# EAGLE design rf24-isp (EAGLE 6.1)
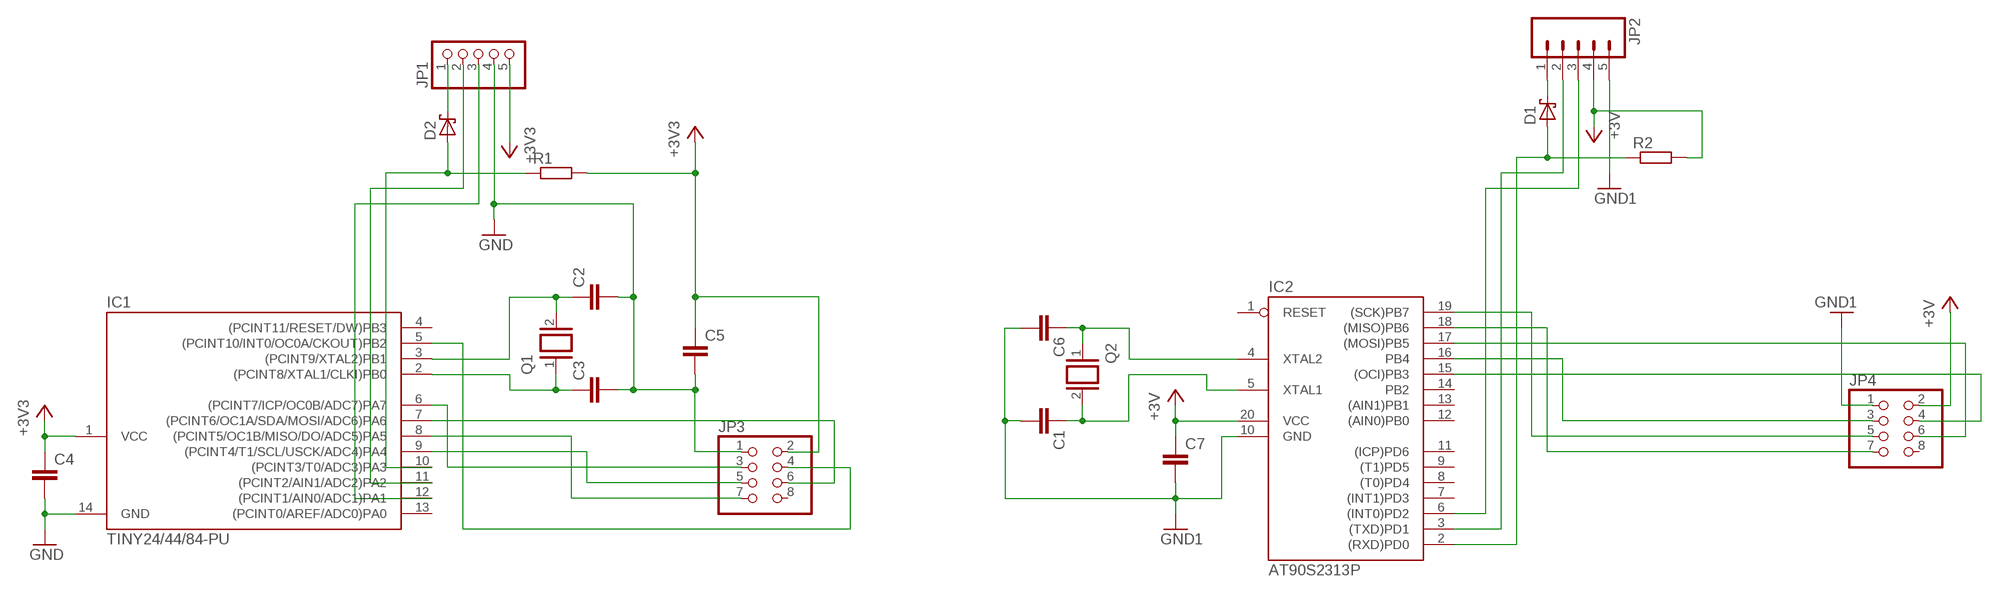
[diagram p0: schematic, sheet 1]

## Parts
C1  C-EU025-025X050  [C025-025X050]
C2  C-EU025-025X050  [C025-025X050]
C3  C-EU025-025X050  [C025-025X050]
C4  C-EU025-025X050  [C025-025X050]
C5  C-EU025-025X050  [C025-025X050]
C6  C-EU025-025X050  [C025-025X050]
C7  C-EU025-025X050  [C025-025X050]
D1  SCHOTTKY-DIODETO92H  [TO92H]
D2  SCHOTTKY-DIODETO92H  [TO92H]
IC1  TINY24/44/84-PU  [DIL14]
IC2  AT90S2313P  [DIL20]
JP1  PINHD-1X5  [1X05]
JP2  M05PTH  [1X05]
JP3  PINHD-2X4  [2X04]
JP4  PINHD-2X4  [2X04]
Q1  XTAL/S  [QS]
Q2  XTAL/S  [QS]
R1  R-EU_0207/12  [0207/12]
R2  R-EU_0207/2V  [0207/2V]

## Nets
+3V3: C4.1 C5.1 C7.1 IC1.1(VCC) IC2.20(VCC) JP1.5 JP2.4 JP3.2 JP4.2 R1.2 R2.2 ; supply symbol labelled +3V
GND: C1.2 C2.2 C3.2 C4.2 C5.2 C6.2 C7.2 IC1.14(GND) IC2.10(GND) JP1.4 JP2.5 JP3.1 JP4.1 ; supply symbol labelled GND1
N$1: C2.1 IC1.3((PCINT9/XTAL2)PB1) Q1.2
N$2: C3.1 IC1.2((PCINT8/XTAL1/CLKI)PB0) Q1.1
N$3: D2.2(C) JP1.1
N$4: IC1.7((PCINT6/OC1A/SDA/MOSI/ADC6)PA6) JP3.6
N$5: IC1.6((PCINT7/ICP/OC0B/ADC7)PA7) JP3.3
N$6: IC1.9((PCINT4/T1/SCL/USCK/ADC4)PA4) JP3.5
N$7: IC1.8((PCINT5/OC1B/MISO/DO/ADC5)PA5) JP3.7
N$8: IC1.5((PCINT10/INT0/OC0A/CKOUT)PB2) JP3.4
N$9: IC2.16(PB4) JP4.3
N$13: D1.2(C) JP2.1
N$14: IC2.19((SCK)PB7) JP4.5
N$15: IC2.18((MISO)PB6) JP4.7
N$16: IC2.17((MOSI)PB5) JP4.6
N$18: IC2.15((OCI)PB3) JP4.4
N$21: C1.1 IC2.5(XTAL1) Q2.2
N$22: C6.1 IC2.4(XTAL2) Q2.1
RST0: IC1.12((PCINT1/AIN0/ADC1)PA1) JP1.3
RST1: IC2.6((INT0)PD2) JP2.3
RX0: IC1.11((PCINT2/AIN1/ADC2)PA2) JP1.2
RX1: IC2.3((TXD)PD1) JP2.2
TX: D2.1(A) IC1.10((PCINT3/T0/ADC3)PA3) R1.1
TX1: D1.1(A) IC2.2((RXD)PD0) R2.1
Unconnected: IC1.4((PCINT11/RESET/DW)PB3) IC1.13((PCINT0/AREF/ADC0)PA0) IC2.1(RESET) IC2.7((INT1)PD3) IC2.8((T0)PD4) IC2.9((T1)PD5) IC2.11((ICP)PD6) IC2.12((AIN0)PB0) IC2.13((AIN1)PB1) IC2.14(PB2) JP3.8 JP4.8

## Library data of the parts
C1-C7 = rcl:C-EU: CAPACITOR, European symbol
D1 D2 = diode:SCHOTTKY-DIODE: Schottky Diode
IC1 = avr-5:TINY24/44/84
IC2 = avr-5:AT90S2313: MICROCONTROLLER 2 Kbytes FLASH 128 bytes SRAM 128 bytes EEPROM UART
JP1 = pinhead:PINHD-1X5: PIN HEADER
JP2 = SparkFun:M05: Header 5 Standard 5-pin 0.1" header. Use with straight break away headers (SKU : PRT-00116), right angle break away headers (PRT-00553), swiss pins (PRT-00743), machine pins (PRT-00117), and female headers (PRT-00115). Molex polarized connector foot print use with SKU : PRT-08230 with associated crimp pins and housings.
JP3 JP4 = pinhead:PINHD-2X4: PIN HEADER
Q1 Q2 = special:XTAL/S: CRYSTAL
R1 R2 = rcl:R-EU_: RESISTOR, European symbol

## Board
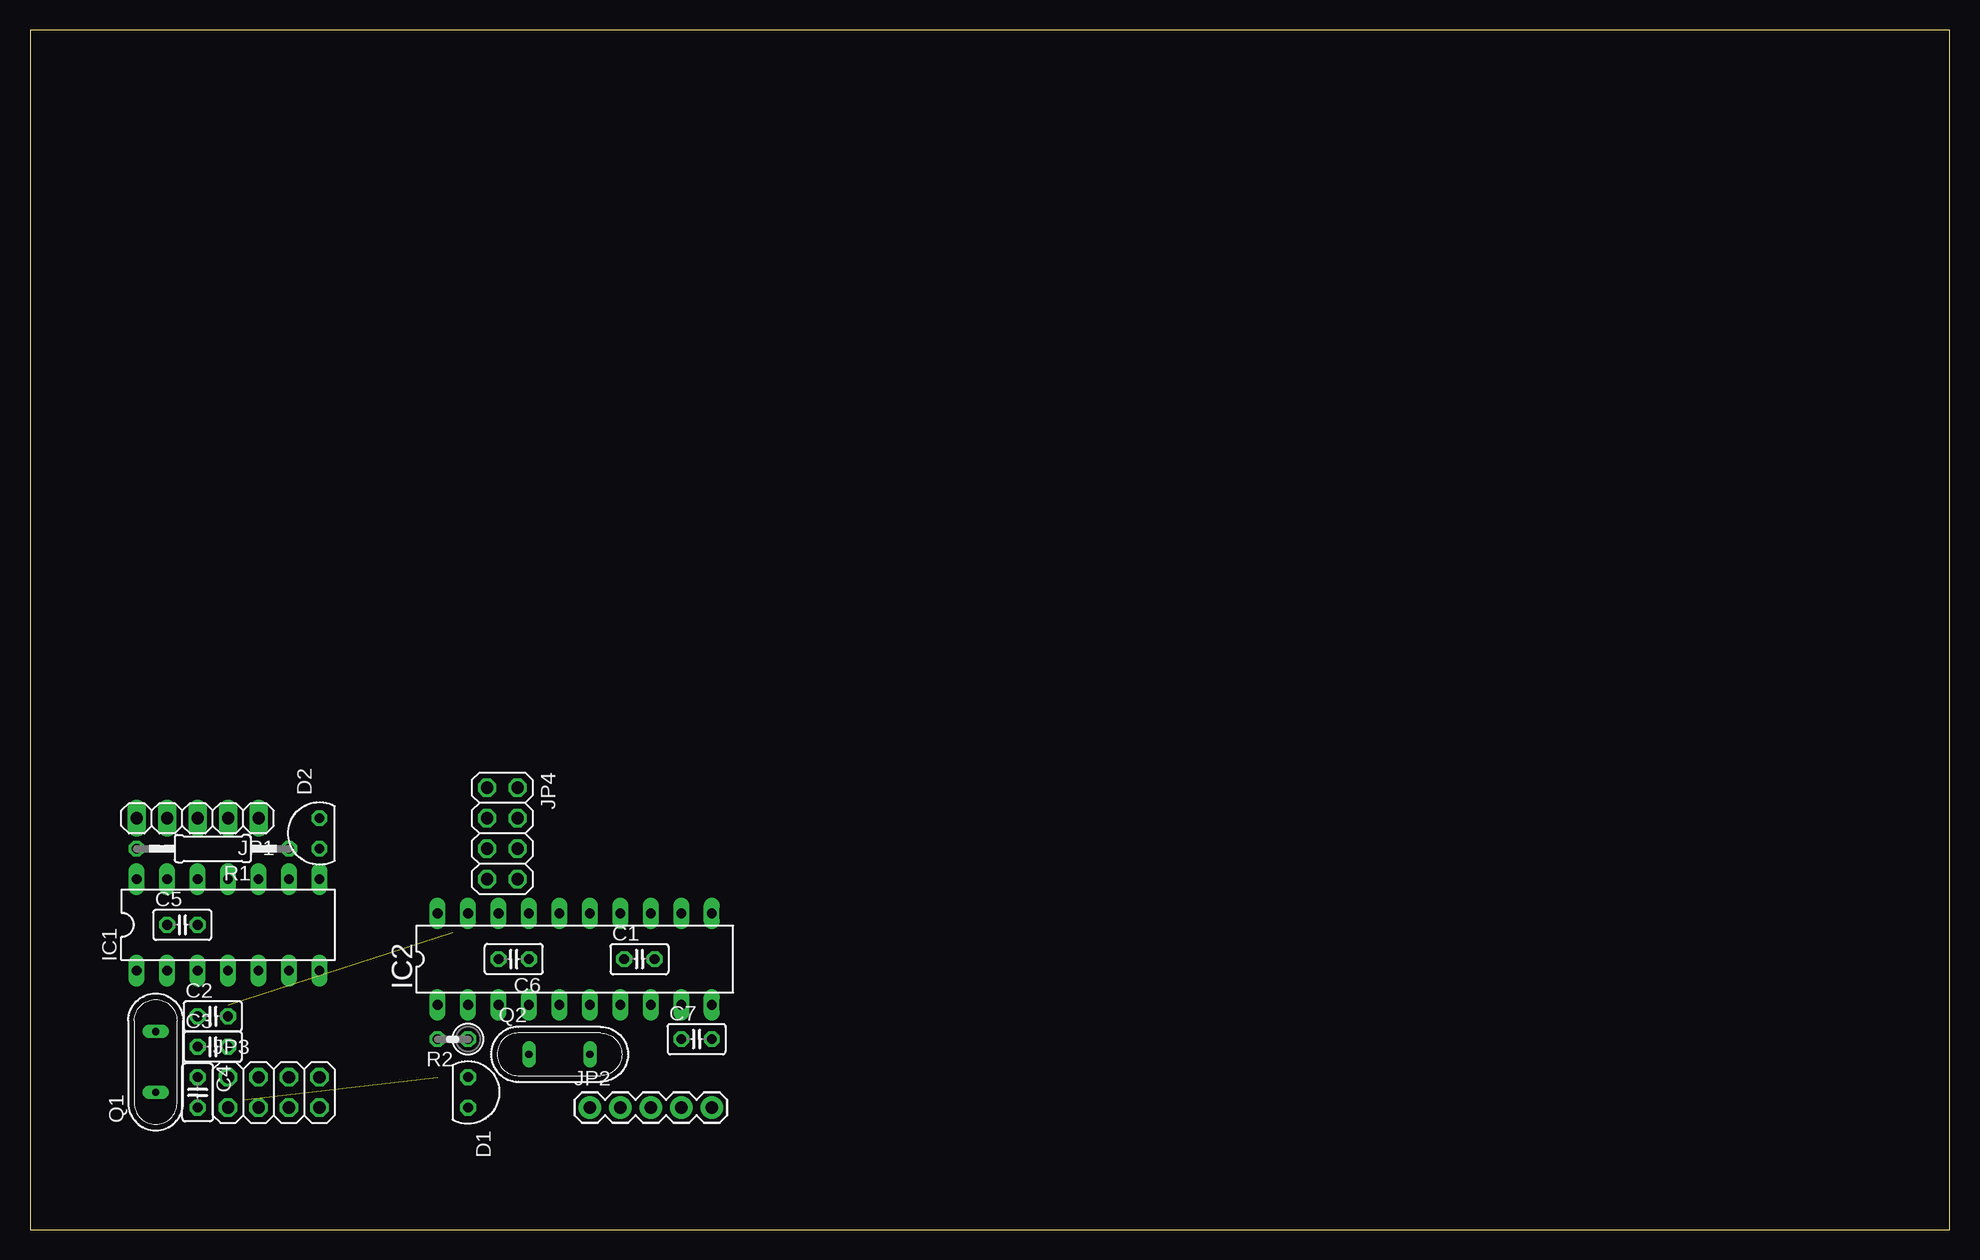
[diagram p1: board, top side]
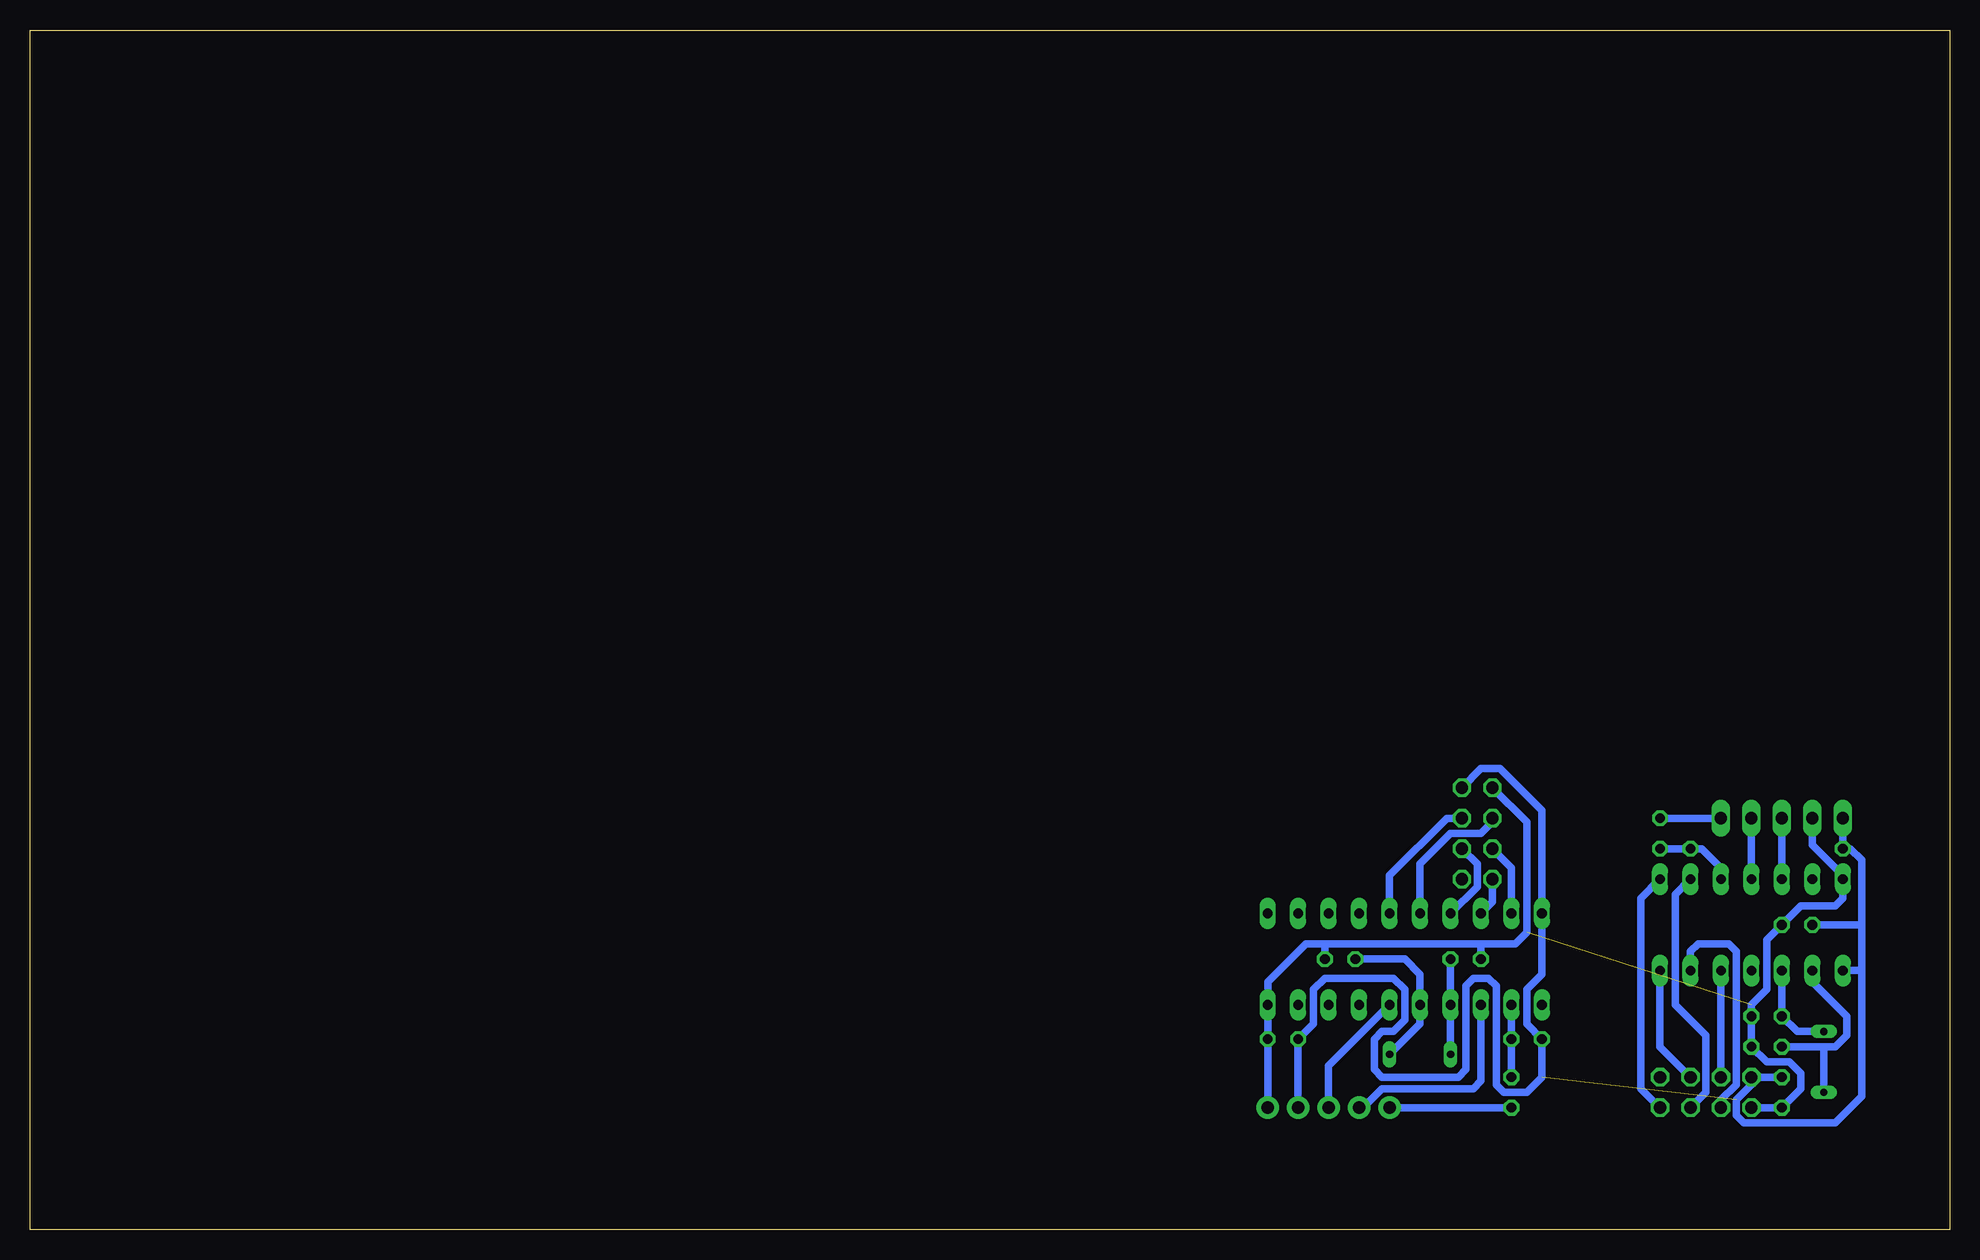
[diagram p2: board, bottom side, seen from below]

Size 160 x 100 mm. Coordinates in mm from the lower left corner, seen from the top.
Outline: 0,0 160,0 160,100 0,100 0,0
Copper layers (1*16): Top 0.035mm / dielectric 1.5mm / Bottom 0.035mm
Design rules: minimum track width 10mil, minimum drill 24mil, track to track 8mil, track to pad 8mil, pad to pad 8mil, via to via 8mil, smd to smd 8mil, copper to edge 40mil, drill to drill 8mil, minimum pad ring 10mil, minimum via ring 8mil, stop-mask expansion 4mil, vias tented up to drill 0mil, thermal gap 10mil

### Footprints (pad centres in the part's own frame; a part is rotated, then mirrored left to right if it is on the bottom)
C025-025X050 = drill 0.813 octagon: 1 -1.27,0; 2 1.27,0
TO92H = drill 0.813 octagon: 1 -1.27,0; 2 1.27,0
DIL14 = drill 0.813 long: 1 -7.62,-3.81; 2 -5.08,-3.81; 3 -2.54,-3.81; 4 0,-3.81; 5 2.54,-3.81; 6 5.08,-3.81; 7 7.62,-3.81; 8 7.62,3.81; 9 5.08,3.81; 10 2.54,3.81; 11 0,3.81; 12 -2.54,3.81; 13 -5.08,3.81; 14 -7.62,3.81
DIL20 = drill 0.813 long: 1 -11.43,-3.81; 2 -8.89,-3.81; 3 -6.35,-3.81; 4 -3.81,-3.81; 5 -1.27,-3.81; 6 1.27,-3.81; 7 3.81,-3.81; 8 6.35,-3.81; 9 8.89,-3.81; 10 11.43,-3.81; 11 11.43,3.81; 12 8.89,3.81; 13 6.35,3.81; 14 3.81,3.81; 15 1.27,3.81; 16 -1.27,3.81; 17 -3.81,3.81; 18 -6.35,3.81; 19 -8.89,3.81; 20 -11.43,3.81
1X05 = drill 1.016 long: 1 -5.08,0; 2 -2.54,0; 3 0,0; 4 2.54,0; 5 5.08,0
1X05' = drill 1.016 pad 1.88: 1 0,0; 2 2.54,0; 3 5.08,0; 4 7.62,0; 5 10.16,0
2X04 = drill 1.016 octagon: 1 -3.81,-1.27; 2 -3.81,1.27; 3 -1.27,-1.27; 4 -1.27,1.27; 5 1.27,-1.27; 6 1.27,1.27; 7 3.81,-1.27; 8 3.81,1.27
QS = drill 0.61 long: 1 -2.54,0; 2 2.54,0
0207/12 = drill 0.813 octagon: 1 -6.35,0; 2 6.35,0
0207/2V = drill 0.813 octagon: 1 -1.27,0; 2 1.27,0

### Placement (x,y rotation side)
C1  50.8,22.54 0 top
C2  15.24,17.78 0 top
C3  15.24,15.24 0 top
C4  13.97,11.43 270 top
C5  12.7,25.4 0 top
C6  40.32,22.54 180 top
C7  55.56,15.88 0 top
D1  36.51,11.43 270 top
D2  24.13,33.02 90 top
IC1  16.51,25.4 0 top
IC2  45.4,22.54 0 top
JP1  13.97,34.29 180 top
JP2  [1X05']  46.67,10.16 0 top
JP3  20.32,11.43 0 top
JP4  39.37,33.02 270 top
Q1  10.48,13.97 90 top
Q2  44.13,14.61 0 top
R1  15.24,31.75 180 top
R2  35.24,15.88 180 top

### Tracks (layer width: path | path; a pad name or v marks a point on that pad's centre or on a via)
+3V3  (1 unrouted)
  Bottom 0.61: JP1.5 R1.2 8.26,31.75 7.3,30.8 7.3,25.4 | C5.1 7.3,25.4 | 7.3,25.4 7.3,21.59 | 7.3,21.59 7.3,11.11 9.53,8.89 17.14,8.89 17.78,9.53 17.78,10.79 16.51,12.06 JP3.2 C4.1 | IC1.1 7.3,21.59 | JP2.4 C7.1 53.02,17.14 53.02,20 52.07,20.95 46.35,20.95 45.4,20 45.4,17.46 46.35,16.51 47.31,16.51 47.94,15.88 47.94,13.34 47.31,12.7 40.96,12.7 40.32,13.34 40.32,20.32 39.69,20.95 38.42,20.95 37.78,20.32 37.78,12.06 37.15,11.43 35.24,11.43 33.97,12.7 R2.2 35.24,17.14 35.24,20 33.97,21.27 IC2.20 33.97,34.92 37.47,38.42 39.05,38.42 JP4.2
GND  (1 unrouted)
  Bottom 0.61: JP1.4 11.43,32.07 8.89,29.53 IC1.14 8.89,27.62 9.53,26.99 12.38,26.99 C5.2 15.24,24.13 15.24,20 16.51,18.73 C2.2 C3.2 15.24,13.97 13.34,13.97 12.38,13.02 12.38,11.75 C4.2 JP3.1 | IC2.10 56.83,20.64 53.66,23.81 52.07,23.81 | IC2.10 56.83,18.41 | JP2.5 C7.2 IC2.10 | C6.2 39.05,23.81 | 39.05,23.81 52.07,23.81 | 52.07,23.81 C1.2 | 39.05,23.81 36.2,23.81 35.24,24.77 35.24,33.97 JP4.1
N$1
  Bottom 0.61: Q1.2 12.7,16.51 C2.1 IC1.3
N$2
  Bottom 0.61: 10.48,15.24 9.53,15.24 8.57,16.19 8.57,17.78 11.43,20.64 IC1.2 11.43,21.91 | C3.1 10.48,15.24 | 10.48,15.24 Q1.1
N$3
  Bottom 0.61: JP1.1 D2.2
N$4
  Bottom 0.61: JP3.6 24.13,15.24 IC1.7
N$5
  Bottom 0.61: JP3.3 19.05,10.79 17.78,12.06 17.78,23.18 18.41,23.81 20.95,23.81 21.59,23.18 IC1.6
N$6
  Bottom 0.61: JP3.5 20.32,11.43 20.32,16.19 22.86,18.73 22.86,27.94 IC1.9
N$7
  Bottom 0.61: JP3.7 25.72,11.75 25.72,27.62 IC1.8
N$8
  Bottom 0.61: IC1.5 JP3.4
N$9
  Bottom 0.61: JP4.3 38.1,33.97 39.05,33.02 41.59,33.02 44.13,30.48 IC2.16
N$13
  Bottom 0.61: D1.2 JP2.1
N$14
  Bottom 0.61: IC2.19 36.51,30.16 JP4.5
N$15
  Bottom 0.61: JP4.7 38.1,27.3 IC2.18
N$16
  Bottom 0.61: JP4.6 39.37,30.48 39.37,28.57 IC2.17
N$18
  Bottom 0.61: JP4.4 41.91,34.29 46.67,29.53 IC2.15
N$21
  Bottom 0.61: C1.1 45.4,22.54 44.13,21.27 IC2.5 44.13,17.14 Q2.2
N$22
  Bottom 0.61: C6.1 IC2.4 Q2.1
RST0
  Bottom 0.61: JP1.3 IC1.12
RST1
  Bottom 0.61: JP2.3 51.75,13.65 IC2.6
RX0
  Bottom 0.61: JP1.2 IC1.11
RX1
  Bottom 0.61: IC2.3 39.05,12.38 39.69,11.75 47.31,11.75 48.9,10.16 JP2.2
TX
  Bottom 0.61: D2.1 R1.1 20.64,31.75 19.05,30.16 IC1.10
TX1
  Bottom 0.61: D1.1 R2.1 IC2.2